# EAGLE design cuckoo (EAGLE 5.06)
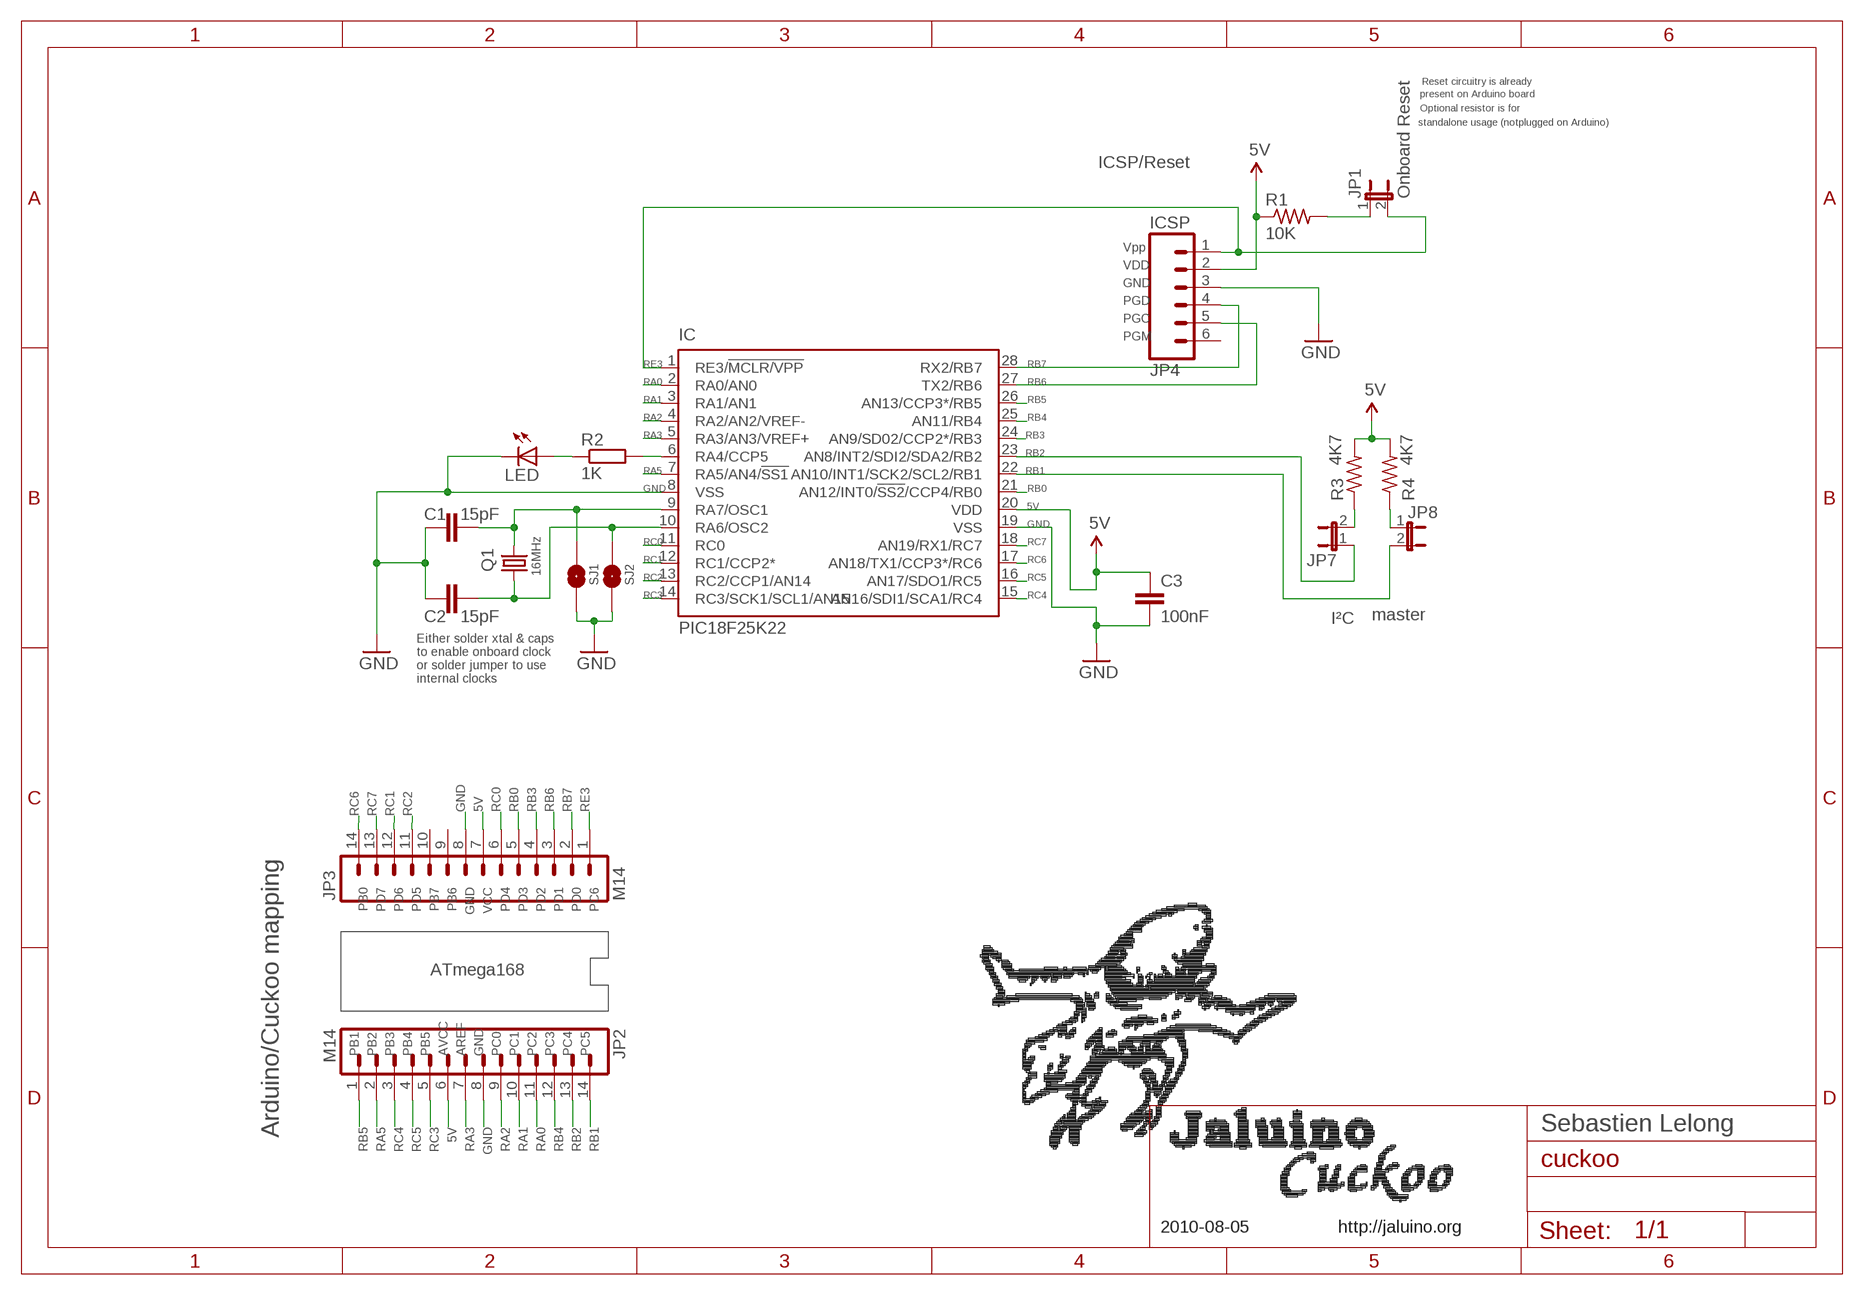
[diagram p0: schematic, sheet 1]

## Parts
C1  15pF  C-EU025-024X044  [C025-024X044]
C2  15pF  C-EU025-024X044  [C025-024X044]
C3  100nF  C2.5/2  [C2.5-2]
IC  PIC18F25K22  PIC18F2580-I/SP  [DIL28-3]
JP1  Onboard Reset  JUMPER-2PTH  [1X02]
JP2  M14  [1X14]
JP3  M14  [1X14]
JP4  ICSP  M06SIP  [1X06]
JP7  I²C  JUMPER-2PTH  [1X02]
JP8  master  JUMPER-2PTH  [1X02]
LED  U57X32  [U57X32]
Q1  16MHz  CRYSTALHC49S  [HC49/S]
R1  10K  R-US_0207/10  [0207/10]
R2  1K  R-EU_0207/7  [0207/7]
R3  4K7  R-US_0207/7  [0207/7]
R4  4K7  R-US_0207/7  [0207/7]
SJ1  SOLDERJUMPERNO  [SJ_2S-NO]
SJ2  SOLDERJUMPERNO  [SJ_2S-NO]

## Nets
5V: C3.1 IC.20(VDD) JP2.6 JP3.7 JP4.2 R1.1 R3.2 R4.2
GND: C1.1 C2.1 C3.2 IC.8(VSS) IC.19(VSS) JP2.8 JP3.8 JP4.3 LED.K(C) SJ1.1 SJ2.1
N$4: C1.2 IC.9(RA7/OSC1) Q1.2 SJ1.2
N$5: JP1.1 R1.2
N$6: IC.6(RA4/CCP5) R2.2
N$7: LED.A R2.1
N$10: JP7.2 R3.1
N$11: JP8.1 R4.1
N$14: C2.2 IC.10(RA6/OSC2) Q1.1 SJ2.2
RA0: IC.2(RA0/AN0) JP2.11
RA1: IC.3(RA1/AN1) JP2.10
RA2: IC.4(RA2/AN2/VREF-) JP2.9
RA3: IC.5(RA3/AN3/VREF+) JP2.7
RA5: IC.7(RA5/AN4/!SS1) JP2.2
RB0: IC.21(AN12/INT0/!SS2!/CCP4/RB0) JP3.5
RB1: IC.22(AN10/INT1/SCK2/SCL2/RB1) JP2.14 JP8.2
RB2: IC.23(AN8/INT2/SDI2/SDA2/RB2) JP2.13 JP7.1
RB3: IC.24(AN9/SD02/CCP2*/RB3) JP3.4
RB4: IC.25(AN11/RB4) JP2.12
RB5: IC.26(AN13/CCP3*/RB5) JP2.1
RB6: IC.27(TX2/RB6) JP3.3 JP4.5
RB7: IC.28(RX2/RB7) JP3.2 JP4.4
RC0: IC.11(RC0) JP3.6
RC1: IC.12(RC1/CCP2*) JP3.12
RC2: IC.13(RC2/CCP1/AN14) JP3.11
RC3: IC.14(RC3/SCK1/SCL1/AN15) JP2.5
RC4: IC.15(AN16/SDI1/SCA1/RC4) JP2.3
RC5: IC.16(AN17/SDO1/RC5) JP2.4
RC6: IC.17(AN18/TX1/CCP3*/RC6) JP3.14
RC7: IC.18(AN19/RX1/RC7) JP3.13
RE3: IC.1(RE3/!MCLR/VPP) JP1.2 JP3.1 JP4.1
Unconnected: JP3.9 JP3.10 JP4.6

## Notes on the sheet
- Reset circuitry is already
- present on Arduino board
- Optional resistor is for
- standalone usage (notplugged on Arduino)
- ICSP/Reset
- Vpp
- VDD
- GND
- PGD
- PGC
- PGM
- Either solder xtal & caps
- to enable onboard clock
- or solder jumper to use
- internal clocks
- PB0 | PD7 | PD6 | PD5 | PB7 | PB6 | GND | VCC | PD4 | PD3 | PD2 | PD1 | PD0 | PC6
- ATmega168
- PB1 | PB2 | PB3 | PB4 | PB5 | AVCC | AREF | GND | PC0 | PC1 | PC2 | PC3 | PC4 | PC5
- Arduino/Cuckoo mapping | Sebastien Lelong
- 2010-08-05 | http://jaluino.org

## Library data of the parts
C1 C2 = rcl:C-EU: CAPACITOR, European symbol
C3 = capacitor-wima:C: CAPACITOR naming: grid - package width
IC = microchip:PIC18F2*80: 28-Pin Enhanced Flash Microcontrollers with ECAN(TM) Technology 10-Bit A/D and nanoWatt Technology Source: http://www.microchip.com .. 39637a.pdf
JP1 JP7 JP8 = SparkFun:JUMPER-2: Jumper Basic 0.1" spaced jumper. Use with breakaway headers.
JP2 JP3 = SparkFun:M14: Header 14 Standard 14-pin 0.1" header. Use with straight break away headers (SKU : PRT-00116), right angle break away headers (PRT-00553), swiss pins (PRT-00743), machine pins (PRT-00117), and female headers (PRT-00115).
JP4 = SparkFun:M06: Header 6 Standard 6-pin 0.1" header. Use with straight break away headers (SKU : PRT-00116), right angle break away headers (PRT-00553), swiss pins (PRT-00743), machine pins (PRT-00117), and female headers (PRT-00115). Molex polarized connector foot print use with SKU : PRT-08094 with associated crimp pins and housings. NOTES ON THE VARIANTS LOCK and LOCK_LONGPADS... This footprint was designed to help hold the alignment of a through-hole component (i.e. 6-pin header) while soldering it into place. You may notice that each hole has been shifted either up or down by 0.005 of an inch from it's more standard position (which is a perfectly straight line). This slight alteration caused the pins (the squares in the middle) to touch the edges of the holes. Because they are alternating, it causes a "brace" to hold the component in place. 0.005 has proven to be the perfect amount of "off-center" position when using our standard breakaway headers. Although looks a little odd when you look at the bare footprint, once you have a header in there, the alteration is very hard to notice. Also, if you push a header all the way into place, it is covered up entirely on the bottom side. This idea of altering the position of holes to aid alignment will be further integrated into the Sparkfun Library for other footprints. It can help hold any component with 3 or more connection pins.
LED = led:U57X32: LED rectangle, 5.7 x 3.2 mm
Q1 = crystal:CRYSTAL: CRYSTAL
R1 R3 R4 = rcl:R-US_: RESISTOR, American symbol
R2 = rcl:R-EU_: RESISTOR, European symbol
SJ1 SJ2 = SparkFun:SOLDERJUMPER: Solder Jumper Standard SMD solder jumper. Used to automate production. Two varients : Normally Open and Normally Closed are the same, but have different paste layers. NC will have a large amount of paste and should jumper during reflow.

## Board
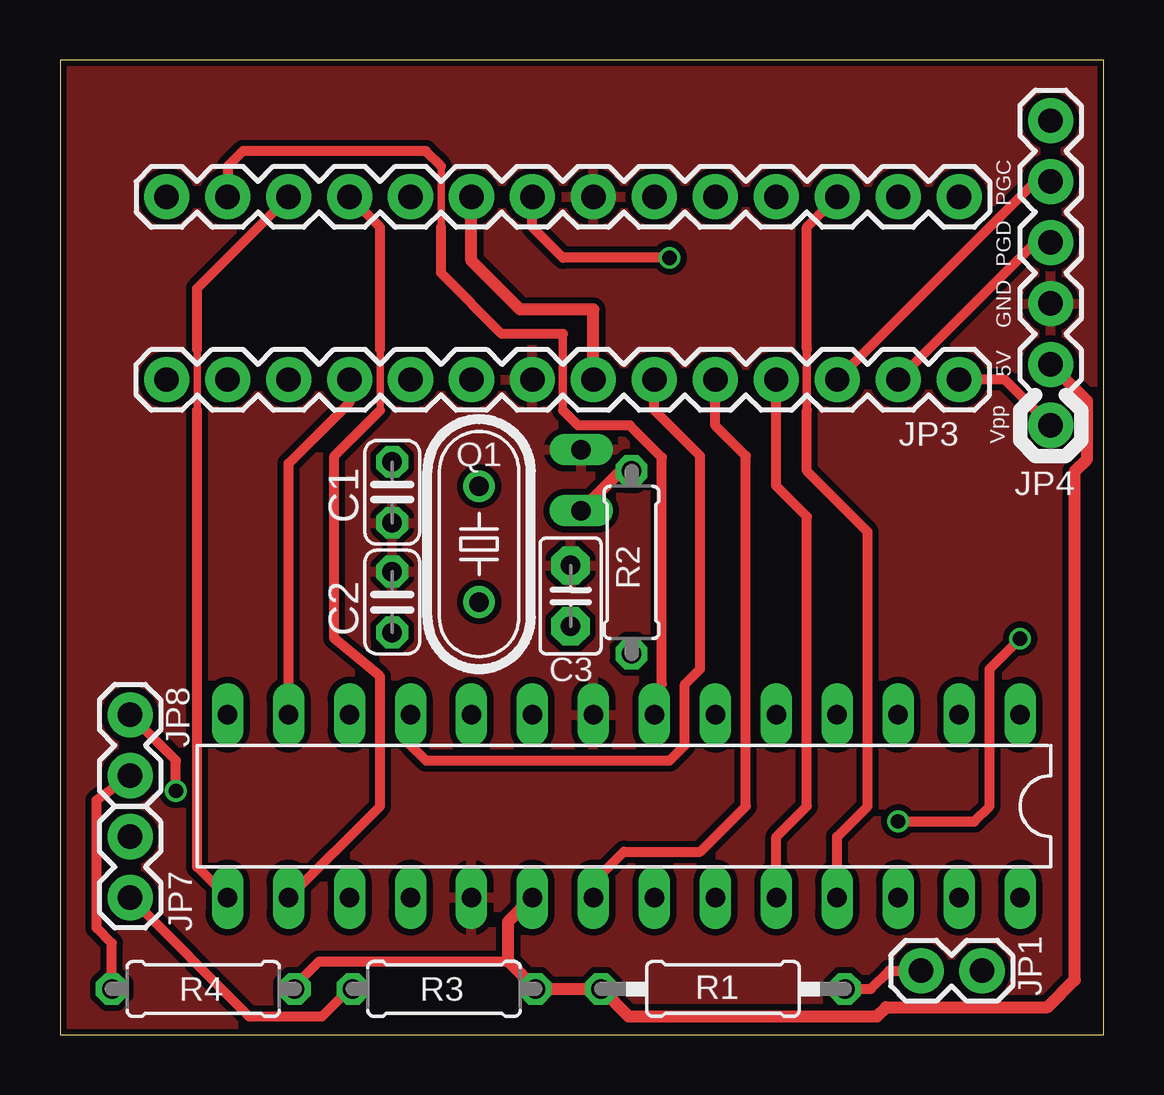
[diagram p1: board, top side]
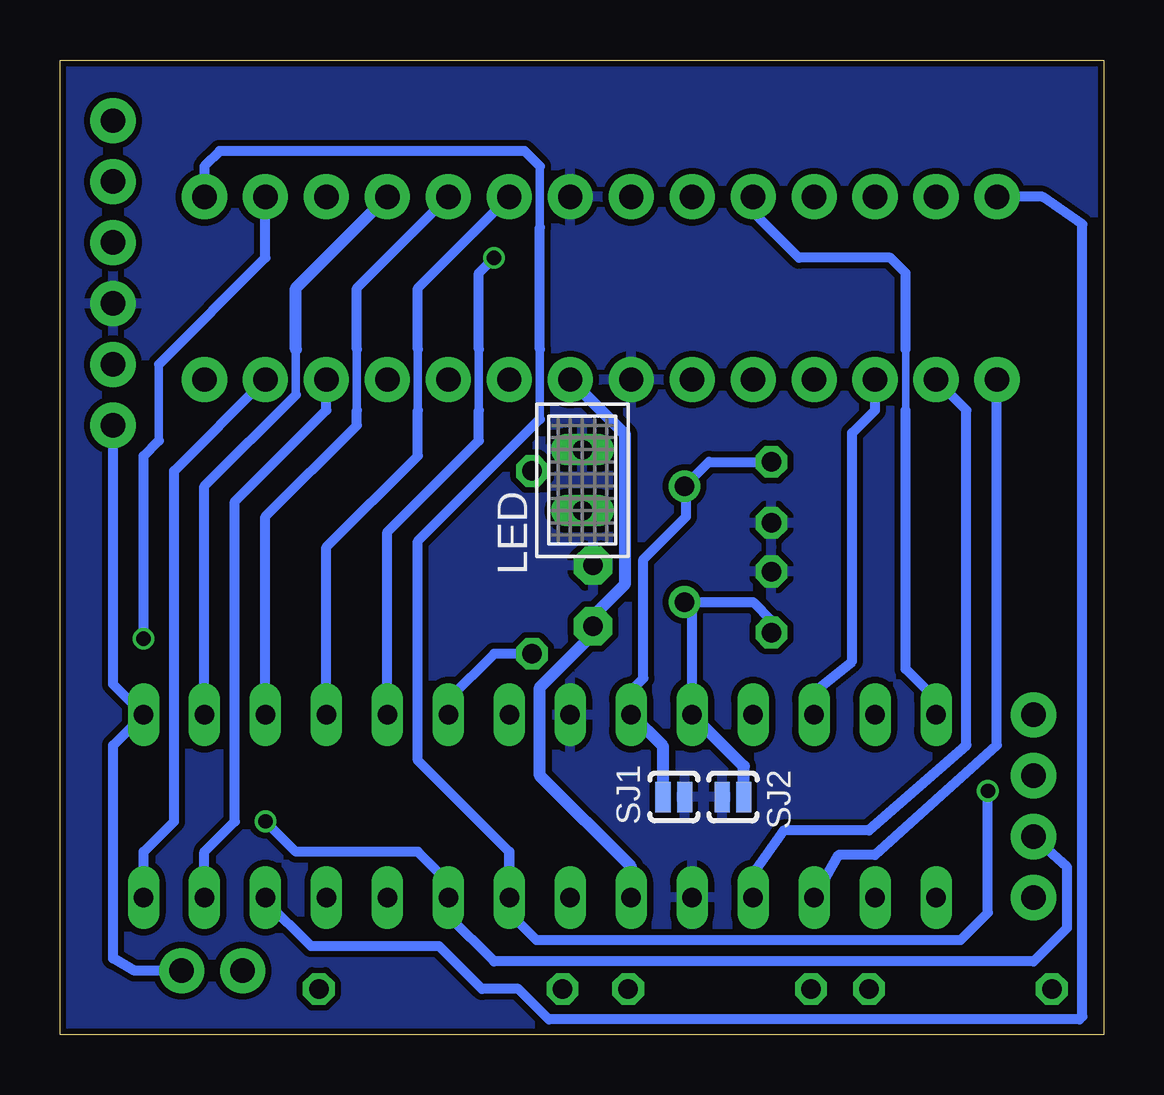
[diagram p2: board, bottom side, seen from below]

Size 43.48 x 40.63 mm. Coordinates in mm from the lower left corner, seen from the top.
Outline: 0,0 43.48,0 43.48,40.63 0,40.63 0,0
Copper layers (1*16): Top 0.035mm / dielectric 1.5mm / Bottom 0.035mm
Design rules "cuckoo": minimum track width 6mil, minimum drill 12mil, track to track 6mil, track to pad 6mil, pad to pad 6mil, via to via 6mil, smd to smd 0mil, copper to edge 10mil, drill to drill 10mil, minimum pad ring 10mil, minimum via ring 6mil, stop-mask expansion 2mil, vias tented up to drill 100mil, thermal gap 10mil

### Footprints (pad centres in the part's own frame; a part is rotated, then mirrored left to right if it is on the bottom)
C025-024X044 = drill 0.813 octagon: 1 -1.27,0; 2 1.27,0
C2.5-2 = drill 0.813 pad 1.6 octagon: 1 -1.27,0; 2 1.27,0
DIL28-3 = drill 0.813 long: 1 -16.51,-3.81; 2 -13.97,-3.81; 3 -11.43,-3.81; 4 -8.89,-3.81; 5 -6.35,-3.81; 6 -3.81,-3.81; 7 -1.27,-3.81; 8 1.27,-3.81; 9 3.81,-3.81; 10 6.35,-3.81; 11 8.89,-3.81; 12 11.43,-3.81; 13 13.97,-3.81; 14 16.51,-3.81; 15 16.51,3.81; 16 13.97,3.81; 17 11.43,3.81; 18 8.89,3.81; 19 6.35,3.81; 20 3.81,3.81; 21 1.27,3.81; 22 -1.27,3.81; 23 -3.81,3.81; 24 -6.35,3.81; 25 -8.89,3.81; 26 -11.43,3.81; 27 -13.97,3.81; 28 -16.51,3.81
1X02 = drill 1.016 pad 1.88 round: 1 0,0; 2 2.54,0
1X14 = drill 1.016 pad 1.88 round: 1 0,0; 2 2.54,0; 3 5.08,0; 4 7.62,0; 5 10.16,0; 6 12.7,0; 7 15.24,0; 8 17.78,0; 9 20.32,0; 10 22.86,0; 11 25.4,0; 12 27.94,0; 13 30.48,0; 14 33.02,0
1X06 = drill 1.016 pad 1.88 round: 1 0,0; 2 2.54,0; 3 5.08,0; 4 7.62,0; 5 10.16,0; 6 12.7,0
U57X32 = drill 0.813 long: A -1.27,0; K 1.27,0
HC49/S = drill 0.813 round: 1 -2.413,0; 2 2.413,0
0207/10 = drill 0.813 octagon: 1 -5.08,0; 2 5.08,0
0207/7 = drill 0.813 octagon: 1 -3.81,0; 2 3.81,0
SJ_2S-NO = smd 0.635 x 1.27: 1 -0.45,0; 2 0.45,0

### Placement (x,y rotation side)
C1  13.84,22.61 90 top
C2  13.84,18.03 270 top
C3  21.27,18.29 90 top
IC  23.5,9.53 180 top
JP1  35.88,2.67 0 top
JP2  4.45,34.92 0 top
JP3  37.47,27.3 180 top
JP4  41.27,25.4 90 top
JP7  2.92,8.26 270 top
JP8  2.92,10.79 90 top
LED  21.72,23.11 90 bottom
Q1  17.46,20.45 90 top
R1  27.62,1.91 0 top
R2  23.81,19.68 270 top
R3  16,1.91 0 top
R4  5.97,1.91 0 top
SJ1  17.91,9.91 180 bottom
SJ2  15.44,9.91 0 bottom

### Tracks (layer width: path | path; a pad name or v marks a point on that pad's centre or on a via)
5V
  Top 0.406: R4.2 9.78,2.03 10.79,3.05 18.67,3.05
  Top 0.508: IC.20 18.67,4.7 18.67,3.05 R3.2 R1.1 23.69,0.76 34.04,0.76 34.42,1.14 41.15,1.14 42.29,2.29 42.29,23.5 42.8,24 42.8,26.42 JP4.2 | JP3.7 22.23,30.23 19.18,30.23 17.14,32.26 JP2.6
  Bottom 0.508: IC.20 19.68,6.99 23.5,10.79 23.5,14.48 21.46,16.51 21.46,16.83 C3.1 21.27,17.46 19.94,18.8 19.94,25.02 JP3.7
GND
  pour Top (isolate 0.254): 0,40.64 43.43,40.64 43.43,0 0,0
  pour Bottom (isolate 0.254): 0,40.64 43.43,40.64 43.43,0 0,0
N$4
  Bottom 0.406: IC.9 19.68,14.35 19.18,14.86 19.18,19.81 17.4,21.59 17.4,22.8 Q1.2 16.45,23.88 C1.2
  Bottom 0.508: SJ1.2 18.36,12.01 IC.9
N$5
  Top 0.406: R1.2 33.78,1.91 34.54,2.67 JP1.1
N$6
  Bottom 0.406: IC.6 27.3,13.97 25.4,15.88 R2.2
N$7
  Top 0.508: R2.1 23.37,23.5 LED.A
N$10
  Top 0.406: R3.1 12.06,1.91 10.92,0.76 7.87,0.76 JP7.2
N$11
  Top 0.406: R4.1 2.16,3.81 1.52,4.45 1.52,9.78 JP8.1
N$14
  Bottom 0.406: C2.2 13.84,17.27 14.61,18.03 Q1.1 17.14,17.72 IC.10
  Bottom 0.508: SJ2.2 14.99,11.18 IC.10
RA0
  Bottom 0.356: 33.66,26.67 33.66,28.57
  Bottom 0.406: IC.2 37.47,22.86 33.66,26.67
  Bottom 0.508: 33.66,28.57 33.66,31.11 JP2.11
RA1
  Bottom 0.356: 31.11,26.04 31.11,28.57
  Bottom 0.406: IC.3 34.92,21.59 31.11,25.4 31.11,26.04 | 31.11,28.57 31.11,31.11 JP2.10
RA2
  Bottom 0.356: 28.57,26.04 28.57,28.57
  Bottom 0.406: IC.4 32.38,20.32 28.57,24.13 28.57,26.04 | JP2.9 28.57,31.11 28.57,28.57
RA3  (via drill 0.6)
  Top 0.406: v25.4,32.38 20.95,32.38 19.68,33.66 JP2.7
  Bottom 0.356: 26.04,26.04 26.04,28.57
  Bottom 0.406: IC.5 29.84,20.95 26.04,24.77 26.04,26.04 | v25.4,32.38 26.04,31.75 26.04,28.57
RA5
  Top 0.305: 15.88,33.66 15.88,36.2
  Top 0.356: 20.95,26.04 20.95,29.21
  Top 0.406: 20.95,29.21 18.41,29.21 15.88,31.75 15.88,33.66 | 15.88,36.2 15.24,36.83 7.62,36.83 6.99,36.2 JP2.2 | IC.7 24.77,14.29 25.08,14.61 25.08,24.07 23.75,25.4 21.59,25.4 20.95,26.04
RB0
  Top 0.406: JP3.5 27.3,25.4 28.57,24.13 28.57,9.53 26.67,7.62 23.5,7.62 22.23,6.35 IC.21
RB1  (via drill 0.6)
  Top 0.406: v4.83,10.16 4.83,11.43 JP8.2
  Bottom 0.356: 23.5,33.66 23.5,36.2 | 23.5,25.65 23.5,28.57
  Bottom 0.406: JP2.14 37.47,36.2 36.83,36.83 24.13,36.83 23.5,36.2 | 24.77,7.62 IC.22 | 23.5,28.57 23.5,33.66 | 24.77,7.62 28.57,11.43 28.57,20.57 23.5,25.65 | 24.77,7.62 24.77,5.08 23.62,3.94 5.97,3.94 4.83,5.08 v4.83,10.16
RB2  (via drill 0.6)
  Top 0.406: v40.01,16.51 38.73,15.24 38.73,9.53 38.1,8.89 v34.92,8.89
  Bottom 0.356: 39.37,24.77 39.37,27.94
  Bottom 0.406: 27.3,6.35 IC.23 | 27.3,6.35 28.57,7.62 33.66,7.62 v34.92,8.89 | JP2.13 34.92,32.38 39.37,27.94 | 39.37,24.77 40.01,24.13 v40.01,16.51 | 27.3,6.35 27.3,4.95 25.4,3.05 2.92,3.05 1.52,4.45 1.52,6.99 JP7.1
RB3
  Top 0.406: JP3.4 29.84,22.86 31.11,21.59 31.11,9.53 29.84,8.26 IC.24
RB4
  Top 0.356: 31.11,26.04 31.11,28.57
  Top 0.406: JP2.12 31.11,33.66 31.11,28.57 | IC.25 32.38,8.26 33.66,9.53 33.66,20.95 31.11,23.5 31.11,26.04
RB5
  Bottom 0.406: JP2.1 2.54,34.92 0.89,33.78 0.89,0.76 1.02,0.64 23.11,0.64 24.38,1.91 25.91,1.91 27.69,3.68 33.02,3.68 34.92,5.59 IC.26
RB6
  Top 0.406: JP3.3 40.64,35.56 JP4.5
  Bottom 0.406: JP3.3 32.38,26.04 36.2,22.23 36.2,8.89 37.47,7.62 IC.27
RB7
  Top 0.406: JP4.4 40.64,33.02 JP3.2
  Bottom 0.406: JP3.2 38.73,23.5 38.73,8.89 40.01,7.62 IC.28
RC0
  Top 0.406: IC.11 14.61,12.06 15.24,11.43 25.4,11.43 26.04,12.06 26.04,14.61 26.67,15.24 26.67,24.13 24.77,26.04 JP3.6
RC1
  Bottom 0.406: IC.12 12.06,14.29 10.48,15.56 10.48,25.08 9.53,26.04 JP3.12
RC2
  Top 0.406: JP3.11 12.06,26.35 9.53,23.81 IC.13
RC3
  Bottom 0.305: 8.26,26.04 8.26,28.57
  Bottom 0.406: JP2.5 14.61,34.29 12.7,32.38 8.89,32.38 8.26,31.75 8.26,28.57 | 8.26,26.04 8.26,15.24 6.99,13.97 IC.14
RC4
  Top 0.305: 5.71,26.04 5.71,28.57
  Top 0.406: JP2.3 5.71,31.11 5.71,28.57 | 5.71,26.04 5.71,6.99 IC.15
RC5
  Top 0.305: 13.34,26.04 13.34,28.57
  Top 0.406: JP2.4 13.34,33.66 13.34,28.57 | IC.16 13.34,9.53 13.34,14.92 11.43,16.51 11.43,24.13 13.34,26.04
RC6
  Bottom 0.406: JP3.14 4.45,12.06 9.53,7.49 11.05,7.49 IC.17
RC7
  Bottom 0.406: IC.18 14.61,6.73 13.34,8.51 9.78,8.51 5.71,12.06 5.71,26.04 JP3.13
RE3
  Top 0.406: JP3.1 39.37,27.3 JP4.1
  Bottom 0.406: JP4.1 41.27,14.61 IC.1 41.27,12.06 41.27,3.17 40.39,2.67 JP1.2

### Text on the board
tNames: PGC | PGD | GND | 5V | Vpp
200bmp: http://jaluino.org | Sébastien Lelong | Jallib/Jaluino Groups | v0.1 / 2010-08-06